# EAGLE design Organ (EAGLE 7.2.0)
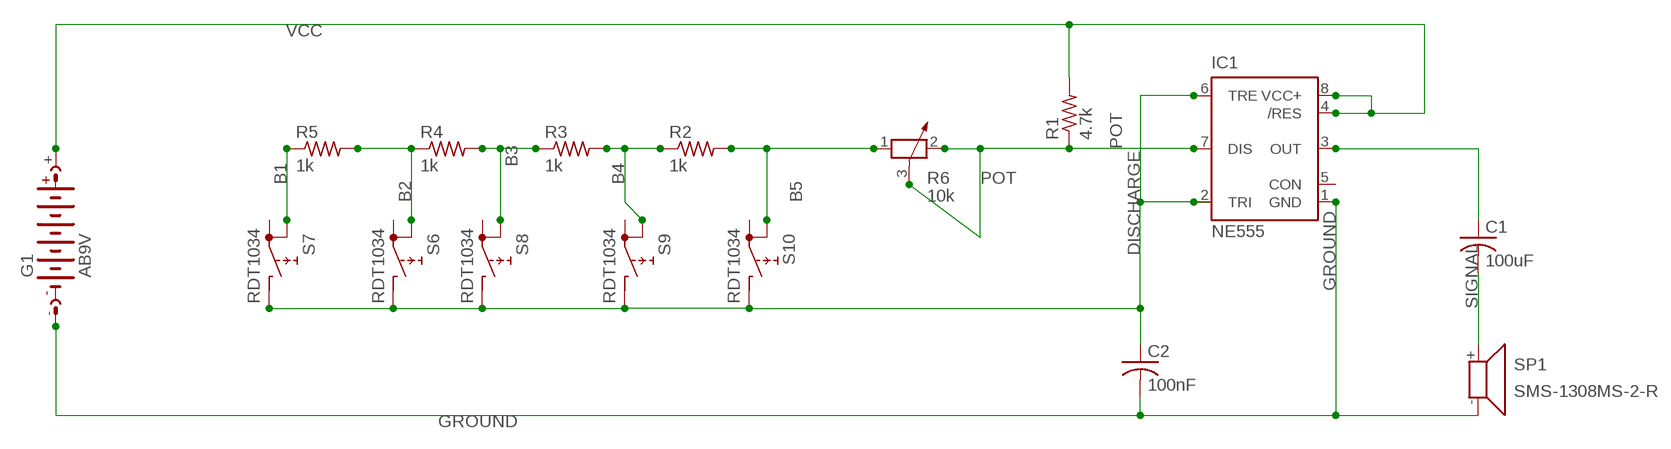
[diagram p0: schematic, sheet 1]

## Parts
C1  100uF  C-USC0805  [C0805]
C2  100nF  C-USC0805  [C0805]
G1  AB9V  [AB9V]
IC1  NE555  [DIL-08]
R1  4.7k  R-US_R0805  [R0805]
R2  1k  R-US_R0805  [R0805]
R3  1k  R-US_R0805  [R0805]
R4  1k  R-US_R0805  [R0805]
R5  1k  R-US_R0805  [R0805]
R6  10k  POTENTIOMETER_PT-10  [PT-10]
S6  RDT1034  [RDT1034]
S7  RDT1034  [RDT1034]
S8  RDT1034  [RDT1034]
S9  RDT1034  [RDT1034]
S10  RDT1034  [RDT1034]
SP1  SMS-1308MS-2-R  [SMS-1308MS-2-R]

## Nets
B1: R5.1 S7.A
B2: R4.1 R5.2 S6.A
B3: R3.1 R4.2 S8.A
B4: R2.1 R3.2 S9.A
B5: R2.2 R6.1 S10.A
DISCHARGE: C2.1 IC1.2(TRI) IC1.6(TRE) S6.B S7.B S8.B S9.B S10.B
GROUND: C2.2 G1.- IC1.1(GND) SP1.-
N$11: C1.1 IC1.3(OUT)
POT: IC1.7(DIS) R1.1 R6.2 R6.3
SIGNAL: C1.2 SP1.+
VCC: G1.+ IC1.4(/RES) IC1.8(VCC+) R1.2
Unconnected: IC1.5(CON) S6.A1 S7.A1 S8.A1 S9.A1 S10.A1

## Library data of the parts
C1 C2 = rcl:C-US: CAPACITOR, American symbol
G1 = battery:AB9V: 9-V BATTERY CLIP
IC1 = st-microelectronics:NE555: General purpose bipolar Timer; MF: Arrow Electronics; MPN: NE555N; OC_FARNELL: 1467742; OC_NEWARK: 89K1486
R1-R5 = rcl:R-US_: RESISTOR, American symbol
R6 = rcl:POTENTIOMETER_: Potentiometer
S6-S10 = switch:RDT1034: PUSH SWITCH www.radiohm.com
SP1 = speaker:SMS-1308MS-2-R: Speaker 13 x 13mm, 8 Ohm, 0.7W Source: pui audio inc. SMS-1308MS-2-R.pdf

## Board
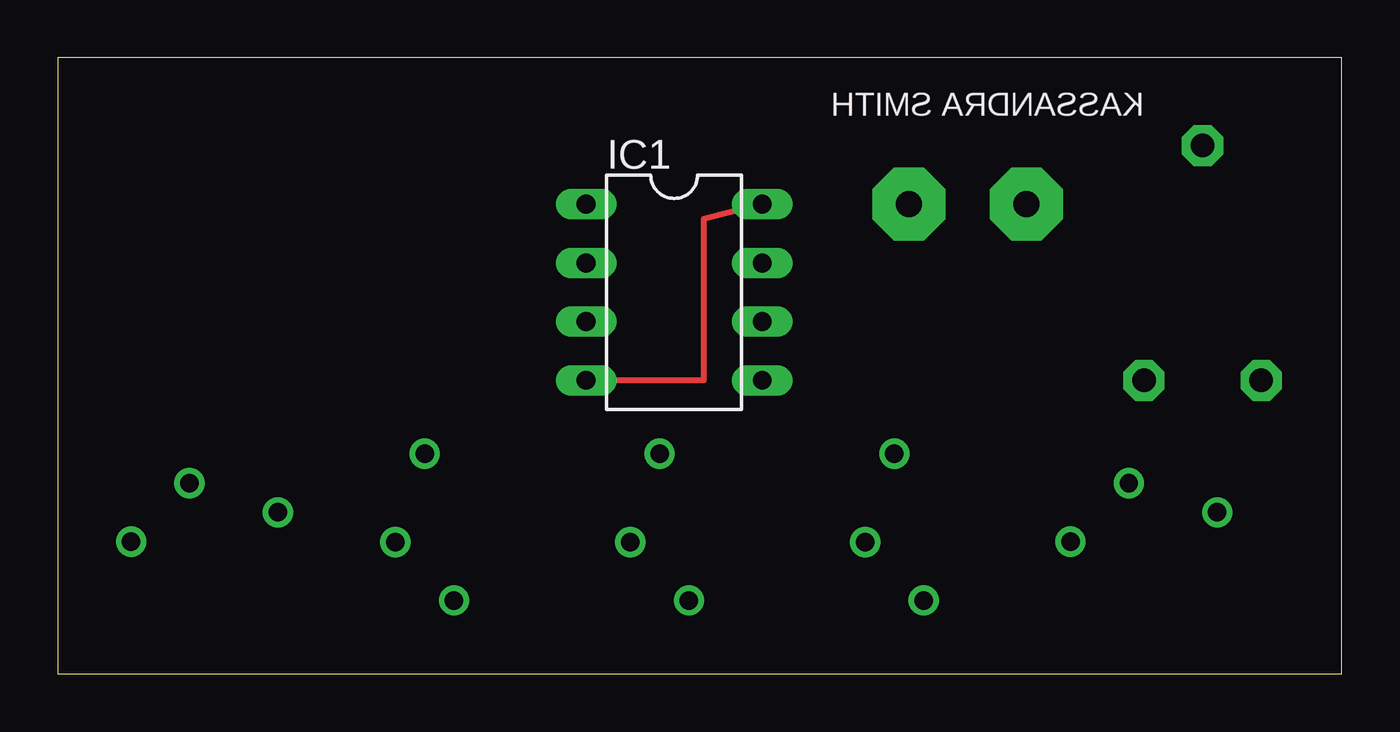
[diagram p1: board, top side]
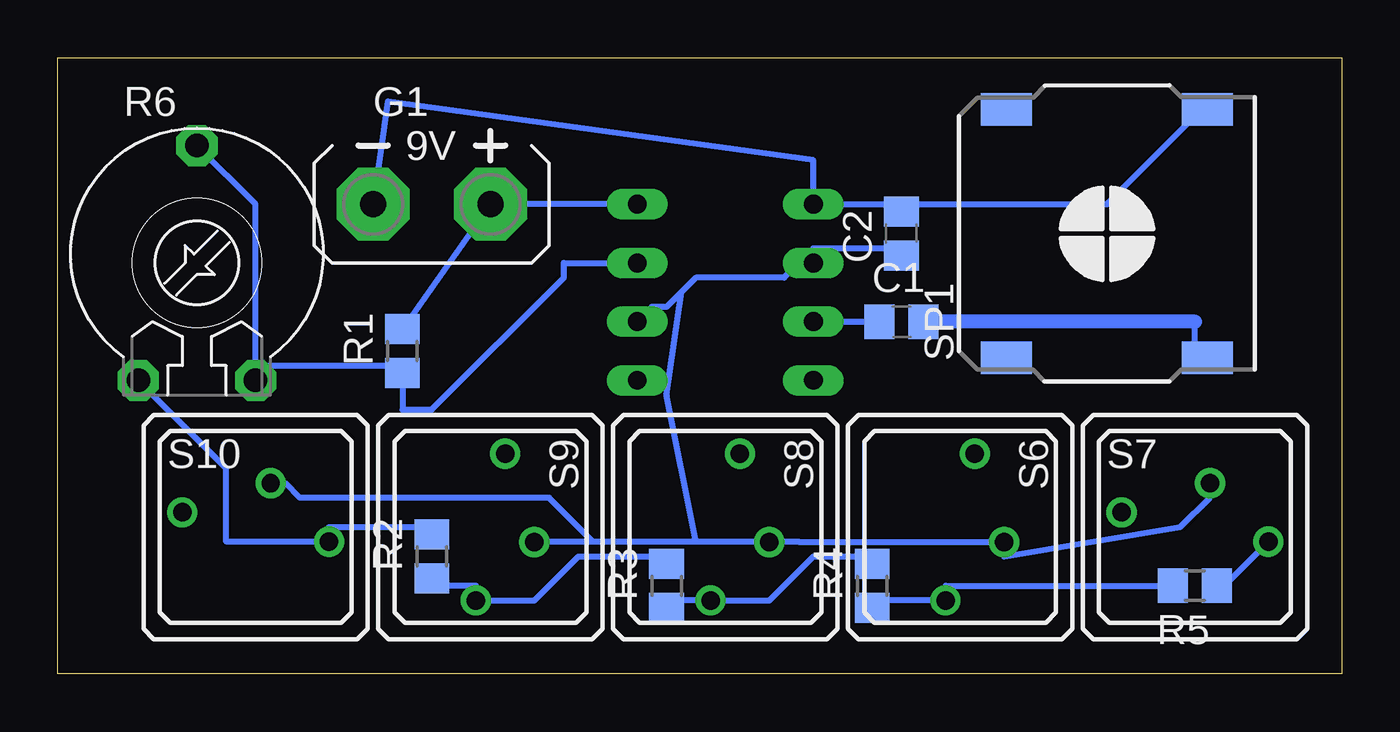
[diagram p2: board, bottom side, seen from below]

Size 55.55 x 26.66 mm. Coordinates in mm from the lower left corner, seen from the top.
Outline: 0,0 55.55,0 55.55,26.66 0,26.66 0,0
Copper layers (1*16): Top 0.035mm / dielectric 1.5mm / Bottom 0.035mm
Design rules "default": minimum track width 10mil, minimum drill 24mil, track to track 8mil, track to pad 8mil, pad to pad 8mil, via to via 8mil, smd to smd 8mil, copper to edge 40mil, drill to drill 8mil, minimum pad ring 10mil, minimum via ring 8mil, stop-mask expansion 4mil, vias tented up to drill 0mil, thermal gap 10mil

### Footprints (pad centres in the part's own frame; a part is rotated, then mirrored left to right if it is on the bottom)
C0805 = smd 1.3 x 1.5: 1 -0.95,0; 2 0.95,0
AB9V = drill 1.118 pad 3.15 octagon: + 0,2.54; - 0,-2.54
DIL-08 = drill 0.813 long: 1 -3.81,-3.81; 2 -1.27,-3.81; 3 1.27,-3.81; 4 3.81,-3.81; 5 3.81,3.81; 6 1.27,3.81; 7 -1.27,3.81; 8 -3.81,3.81
R0805 = smd 1.3 x 1.5: 1 -0.95,0; 2 0.95,0
PT-10 = drill 1.016 pad 1.778 octagon: 1 -2.54,-5.08; 2 2.54,-5.08; 3 0,5.08
RDT1034 = drill 0.8: A 3.175,-0.635; A1 -3.175,0.635; B 0.65,1.9
SMS-1308MS-2-R = smd 1.4 x 2.2: + -5.375,-4.35; - 5.375,-4.35; M1 -5.375,4.35; M2 5.375,4.35

### Placement (x,y rotation side)
C1  19.05,15.24 0 bottom
C2  19.05,19.05 90 bottom
G1  39.37,20.32 270 bottom
IC1  26.67,16.51 270 top
R1  40.64,13.97 90 bottom
R2  39.37,5.08 90 bottom
R3  29.21,3.81 90 bottom
R4  20.32,3.81 90 bottom
R5  6.35,3.81 180 bottom
R6  49.53,17.78 0 bottom
S6  16.51,6.35 270 bottom
S7  6.35,6.35 0 bottom
S8  26.67,6.35 270 bottom
S9  36.83,6.35 270 bottom
S10  46.99,6.35 0 bottom
SP1  10.16,19.05 90 bottom

### Tracks (layer width: path | path; a pad name or v marks a point on that pad's centre or on a via)
B1
  Bottom 0.254: S7.A 5.08,3.81 R5.1
B2
  Bottom 0.254: R5.2 17.14,3.81 S6.A 20.32,3.17 R4.1
B3
  Bottom 0.254: R3.1 29.21,3.17 S8.A 24.77,3.17 22.86,5.08 20.32,5.08 R4.2
B4
  Bottom 0.254: R3.2 29.21,5.08 33.02,5.08 34.92,3.17 S9.A 37.47,3.81 39.37,3.81 R2.1
B5
  Bottom 0.254: R2.2 39.37,6.35 43.81,6.35 S10.A 48.26,5.71 48.26,8.89 R6.1
DISCHARGE
  Bottom 0.254: C2.1 19.05,18.41 22.86,18.41 IC1.2 23.5,17.78 24.13,17.14 27.94,17.14 28.57,16.51 | IC1.6 29.84,15.88 29.21,15.88 28.57,16.51 | 27.94,5.71 25.4,5.71 S8.B 23.5,5.71 15.24,5.71 S6.B 14.61,5.08 6.99,6.35 5.71,7.62 S7.B | 27.94,5.71 32.38,5.71 | 32.38,5.71 34.92,5.71 S9.B | 32.38,5.71 34.29,7.62 45.09,7.62 45.72,8.25 S10.B | 28.57,16.51 29.21,12.06 27.94,5.71
GROUND
  Bottom 0.254: 19.05,20.32 IC1.1 22.86,22.22 41.27,24.77 G1.- | 19.05,20.32 10.16,20.32 6.35,24.13 SP1.- | 19.05,20.32 C2.2
N$11
  Bottom 0.254: IC1.3 C1.1
POT
  Bottom 0.254: 46.99,13.33 40.64,13.33 R1.1 40.64,11.43 39.37,11.43 33.66,17.14 33.66,17.78 IC1.7 | R6.3 46.99,20.32 46.99,13.33 | 46.99,13.33 R6.2
SIGNAL
  Bottom 0.254: 6.35,15.24 6.35,13.97 SP1.+
  Bottom 0.61: 6.35,15.24 C1.2
VCC
  Top 0.254: IC1.4 27.94,12.7 27.94,19.69 IC1.8
  Bottom 0.254: R1.2 G1.+ IC1.8

### Text on the board
tNames: KASSANDRA SMITH